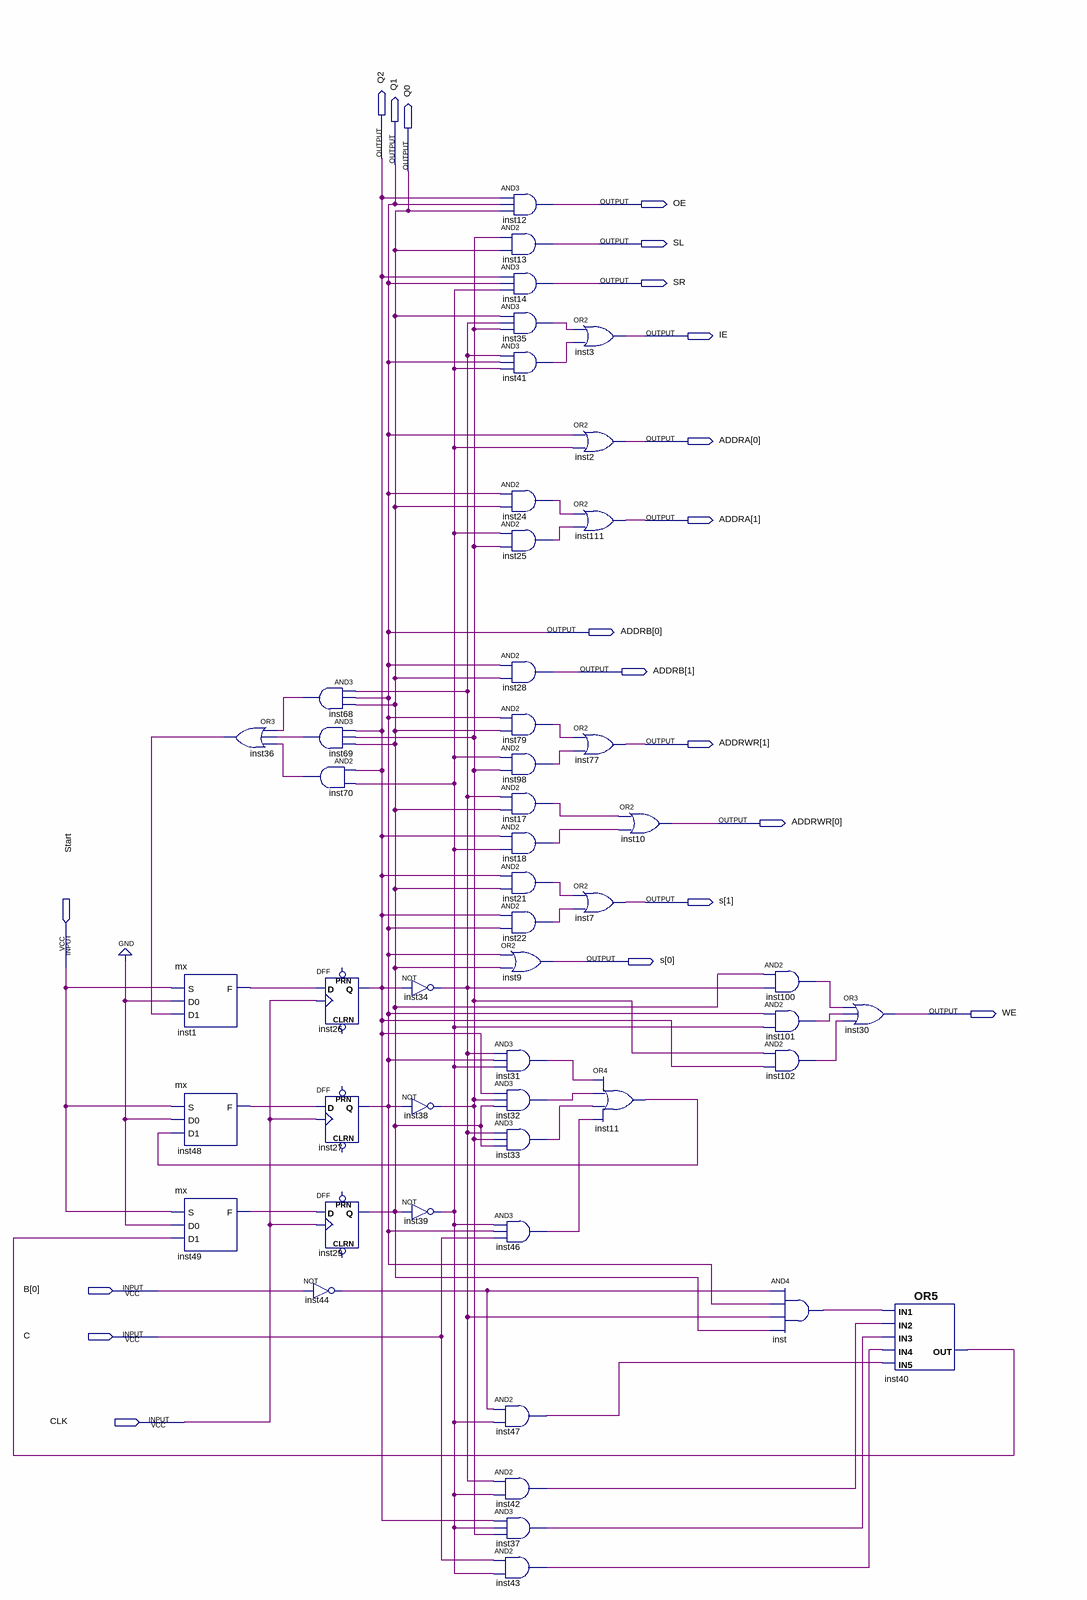
[diagram p0: schematic sheet]
// Quartus schematic Control.bdf as structural Verilog: 50 symbols, 20 pins
module Control (
  input  Start,
  input  [0:0] B,
  input  C,
  input  CLK,
  output Q2,
  output Q1,
  output Q0,
  output OE,
  output SL,
  output SR,
  output IE,
  output [1:0] ADDRA,
  output [1:0] ADDRB,
  output [1:0] ADDRWR,
  output [1:0] s,
  output WE
);

  wire inst1_f, inst11_out, inst17_out, inst18_out, inst21_out, inst22_out, inst24_out, inst25_out,
       inst31_out, inst32_out, inst33_out, inst34_out, inst35_out, inst36_out, inst37_out, inst38_out,
       inst39_out, inst40_out, inst41_out, inst42_out, inst43_out, inst44_out, inst46_out, inst47_out,
       inst48_f, inst49_f, inst68_out, inst69_out, inst70_out, inst79_out, inst98_out, inst100_out,
       inst101_out, inst102_out, inst_out;

  mx inst1 (.S(Start), .D0(1'b0), .D1(inst36_out), .F(inst1_f));
  mx inst48 (.S(Start), .D0(1'b0), .D1(inst11_out), .F(inst48_f));
  mx inst49 (.S(Start), .D0(1'b0), .D1(inst40_out), .F(inst49_f));
  or inst36 (inst36_out, inst68_out, inst69_out, inst70_out);
  and inst68 (inst68_out, inst34_out, ADDRB[0], Q0);
  and inst69 (inst69_out, Q2, inst38_out, Q0);
  and inst70 (inst70_out, Q2, inst39_out);
  DFF inst26 (.CLK(CLK), .D(inst1_f), .Q(Q2));  // open: CLRN, PRN
  DFF inst27 (.CLK(CLK), .D(inst48_f), .Q(ADDRB[0]));  // open: CLRN, PRN
  DFF inst29 (.CLK(CLK), .D(inst49_f), .Q(Q0));  // open: CLRN, PRN
  not inst44 (inst44_out, B[0]);
  not inst34 (inst34_out, Q2);
  not inst38 (inst38_out, ADDRB[0]);
  not inst39 (inst39_out, Q0);
  and inst12 (OE, Q2, ADDRB[0], Q0);
  and inst13 (SL, inst38_out, Q0);
  and inst14 (SR, Q2, ADDRB[0], inst39_out);
  and inst35 (inst35_out, Q0, inst34_out, inst38_out);
  and inst41 (inst41_out, inst34_out, ADDRB[0], inst39_out);
  and inst24 (inst24_out, ADDRB[0], Q0);
  and inst25 (inst25_out, inst39_out, inst38_out);
  and inst28 (ADDRB[1], ADDRB[0], Q0);
  and inst79 (inst79_out, ADDRB[0], Q0);
  and inst98 (inst98_out, inst39_out, inst38_out);
  and inst17 (inst17_out, inst34_out, Q0);
  and inst18 (inst18_out, Q2, inst39_out);
  and inst21 (inst21_out, Q2, Q0);
  and inst22 (inst22_out, Q2, ADDRB[0]);
  or inst9 (s[0], ADDRB[0], Q0);
  and inst31 (inst31_out, inst34_out, ADDRB[0], inst39_out);
  and inst32 (inst32_out, Q2, inst38_out, Q0);
  and inst33 (inst33_out, inst34_out, inst38_out, Q0);
  and inst46 (inst46_out, inst39_out, ADDRB[0], C);
  and inst47 (inst47_out, inst44_out, inst39_out);
  and inst42 (inst42_out, inst34_out, inst39_out);
  and inst37 (inst37_out, Q2, inst39_out, inst38_out);
  and inst43 (inst43_out, C, inst39_out);
  or inst3 (IE, inst35_out, inst41_out);
  or inst2 (ADDRA[0], ADDRB[0], inst39_out);
  or inst111 (ADDRA[1], inst24_out, inst25_out);
  or inst77 (ADDRWR[1], inst79_out, inst98_out);
  or inst7 (s[1], inst21_out, inst22_out);
  or inst11 (inst11_out, inst31_out, inst32_out, inst33_out, inst46_out);
  or inst10 (ADDRWR[0], inst17_out, inst18_out);
  and inst100 (inst100_out, Q0, inst34_out);
  and inst101 (inst101_out, ADDRB[0], inst39_out);
  and inst102 (inst102_out, inst38_out, Q2);
  and inst (inst_out, inst44_out, ADDRB[0], inst34_out, Q0);
  or inst30 (WE, inst100_out, inst101_out, inst102_out);
  or inst40 (inst40_out, inst_out, inst42_out, inst37_out, inst43_out, inst47_out);

  assign Q1 = ADDRB[0];
endmodule
